# EAGLE design ESP-balanced-mic-line-driver (EAGLE 9.6.2)
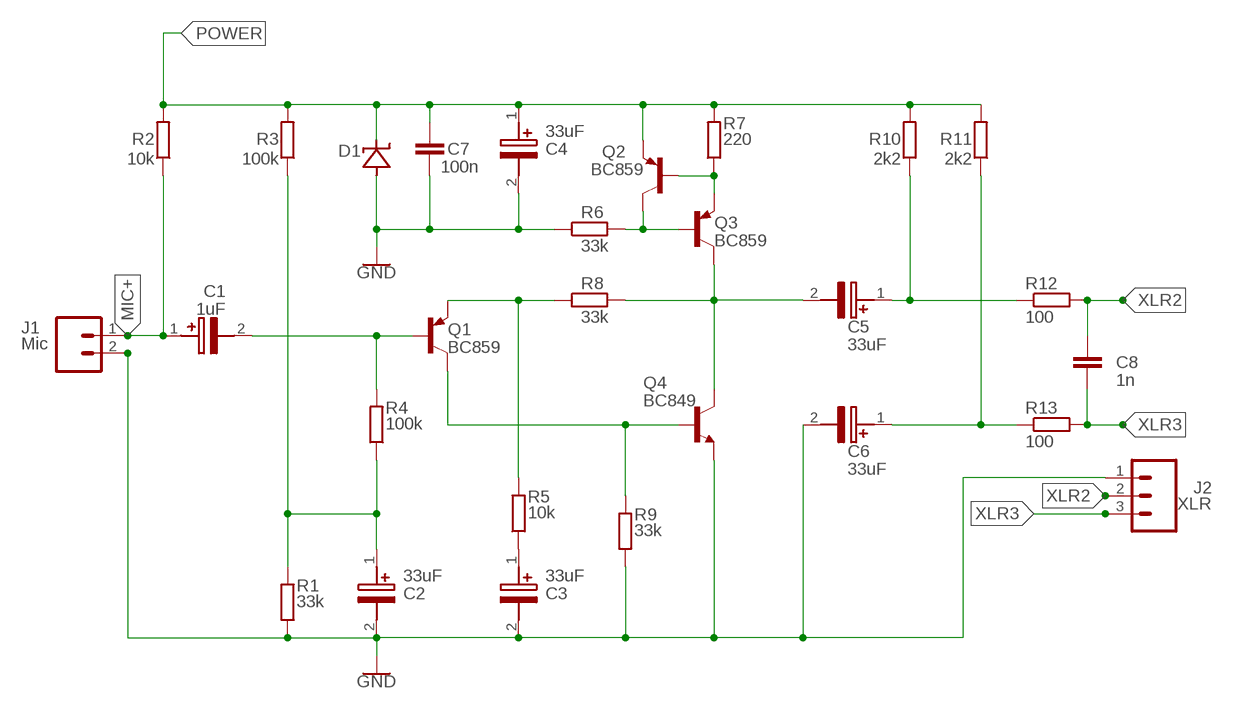
[diagram p0: schematic, sheet 1]

## Parts
C1  1uF  865080442006  [CAPAE530X550N]
C2  33uF  865080442006  [CAPAE530X550N]
C3  33uF  865080442006  [CAPAE530X550N]
C4  33uF  865080442006  [CAPAE530X550N]
C5  33uF  865080442006  [CAPAE530X550N]
C6  33uF  865080442006  [CAPAE530X550N]
C7  100n  C-EUC1210  [C1210]
C8  1n  C-EUC0805  [C0805]
D1  ZENER_D  [SOD123]
J1  Mic  CONN_02  [1X02]
J2  XLR  CONN_03  [1X03]
Q1  BC859  [SOT23-BEC]
Q2  BC859  [SOT23-BEC]
Q3  BC859  [SOT23-BEC]
Q4  BC849  [SOT23-BEC]
R1  33k  R_0603  [R0603]
R2  10k  R_0603  [R0603]
R3  100k  R_0603  [R0603]
R4  100k  R_0603  [R0603]
R5  10k  R_0603  [R0603]
R6  33k  R_0603  [R0603]
R7  220  R_0603  [R0603]
R8  33k  R_0603  [R0603]
R9  33k  R_0603  [R0603]
R10  2k2  R_0603  [R0603]
R11  2k2  R_0603  [R0603]
R12  100  R_0603  [R0603]
R13  100  R_0603  [R0603]

## Nets
GND: C2.2(-) C3.2(-) C4.2(-) C6.2(-) C7.2 D1.A J1.2 J2.1 Q4.E R1.1 R6.1 R9.1
MIC+: C1.1(+) J1.1 R2.1
N$1: C5.2(-) Q3.C Q4.C R8.2
N$2: Q2.C Q3.B R6.2
N$3: C3.1(+) R5.1
N$7: C5.1(+) R10.1 R12.1
N$8: C6.1(+) R11.1 R13.1
N$9: Q2.B Q3.E R7.1
N$13: C2.1(+) R1.2 R3.1 R4.1
N$15: C1.2(-) Q1.B R4.2
N$16: Q1.E R5.2 R8.1
N$17: Q1.C Q4.B R9.2
POWER: C4.1(+) C7.1 D1.C Q2.E R2.2 R3.2 R7.2 R10.2 R11.2
XLR2: C8.1 J2.2 R12.2
XLR3: C8.2 J2.3 R13.2

## Library data of the parts
C1-C6 = SamacSys_Parts:865080442006: Wurth Elektronik 33uF 25 V Aluminium Electrolytic Capacitor, WCAP-ASLI Series 2000h 5 (Dia.) x 5.35mm Source: Datasheet; DESCRIPTION: Wurth Elektronik 33uF 25 V Aluminium Electrolytic Capacitor, WCAP-ASLI Series 2000h 5 (Dia.) x 5.35mm; HEIGHT: 5.5mm; MANUFACTURER_NAME: Wurth Elektronik; MANUFACTURER_PART_NUMBER: 865080442006; MOUSER_PART_NUMBER: 710-865080442006; MOUSER_PRICE-STOCK: https://www.mouser.co.uk/ProductDetail/Wurth-Elektronik/865080442006?qs=0KOYDY2FL28yYWna6YwhXg%3D%3D
C7 C8 = rcl:C-EU: CAPACITOR, European symbol; SPICEPREFIX: C
D1 = MKF:ZENER_D
J1 = MKF:CONN_02: Multi connection point. Often used as Generic Header-pin footprint for 0.1 inch spaced/style header connections On any of the 0.1 inch spaced packages, you can populate with these: Break Away Headers - Straight <https://www.sparkfun.com/products/116> (PRT-00116) Break Away Male Headers - Right Angle <https://www.sparkfun.com/products/553> (PRT-00553) Female Headers <https://www.sparkfun.com/products/115> (PRT-00115) Break Away Headers - Machine Pin <https://www.sparkfun.com/products/117> (PRT-00117) Break Away Female Headers - Swiss Machine Pin <https://www.sparkfun.com/products/743> (PRT-00743) For SCREWTERMINALS and SPRING TERMINALS visit here: Screw Terimnals on SparkFun.com <https://www.sparkfun.com/search/results?term=Screw+Terminals> (5mm/3.5mm/2.54mm spacing) This device is also useful as a general connection point to wire up your design to another part of your project. Our various solder wires solder well into these plated through hole pads. Hook-Up Wire - Assortment (Stranded, 22 AWG) <https://www.sparkfun.com/products/11375> (PRT-11375) Hook-Up Wire - Assortment (Solid Core, 22 AWG) <https://www.sparkfun.com/products/11367> (PRT-11367) View the entire wire category on our website here <https://www.sparkfun.com/categories/141> Special notes: Molex polarized connector foot print use with: PRT-08233 with associated crimp pins and housings. 2.54_SCREWTERM for use with PRT-10571. 3.5mm Screw Terminal footprints for PRT-08084 5mm Screw Terminal footprints for use with PRT-08432
J2 = MKF:CONN_03: Multi connection point. Often used as Generic Header-pin footprint for 0.1 inch spaced/style header connections On any of the 0.1 inch spaced packages, you can populate with these: Break Away Headers - Straight <https://www.sparkfun.com/products/116> (PRT-00116) Break Away Male Headers - Right Angle <https://www.sparkfun.com/products/553> (PRT-00553) Female Headers <https://www.sparkfun.com/products/115> (PRT-00115) Break Away Headers - Machine Pin <https://www.sparkfun.com/products/117> (PRT-00117) Break Away Female Headers - Swiss Machine Pin <https://www.sparkfun.com/products/743> (PRT-00743) Stackable Header - 3 Pin (Female, 0.1") <https://www.sparkfun.com/products/13875> (PRT-13875) For SCREWTERMINALS and SPRING TERMINALS visit here: Screw Terimnals on SparkFun.com <https://www.sparkfun.com/search/results?term=Screw+Terminals> (5mm/3.5mm/2.54mm spacing) This device is also useful as a general connection point to wire up your design to another part of your project. Our various solder wires solder well into these plated through hole pads. Hook-Up Wire - Assortment (Stranded, 22 AWG) <https://www.sparkfun.com/products/11375> (PRT-11375) Hook-Up Wire - Assortment (Solid Core, 22 AWG) <https://www.sparkfun.com/products/11367> (PRT-11367) View the entire wire category on our website here <https://www.sparkfun.com/categories/141> Special notes: Molex polarized connector foot print use with SKU : PRT-08232 with associated crimp pins and housings.
Q1-Q3 = MKF:BC859
Q4 = MKF:BC849
R1-R13 = MKF:R_0603

## Board
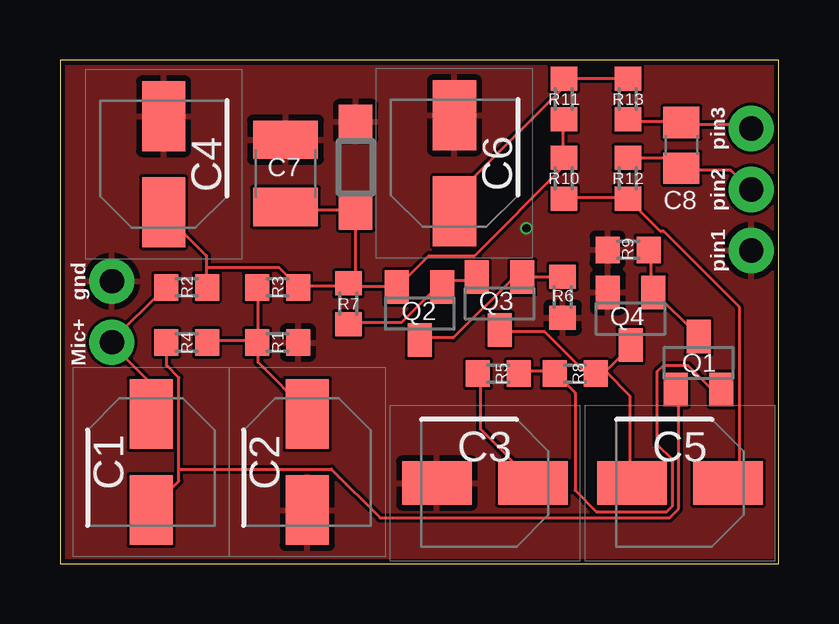
[diagram p1: board, top side]
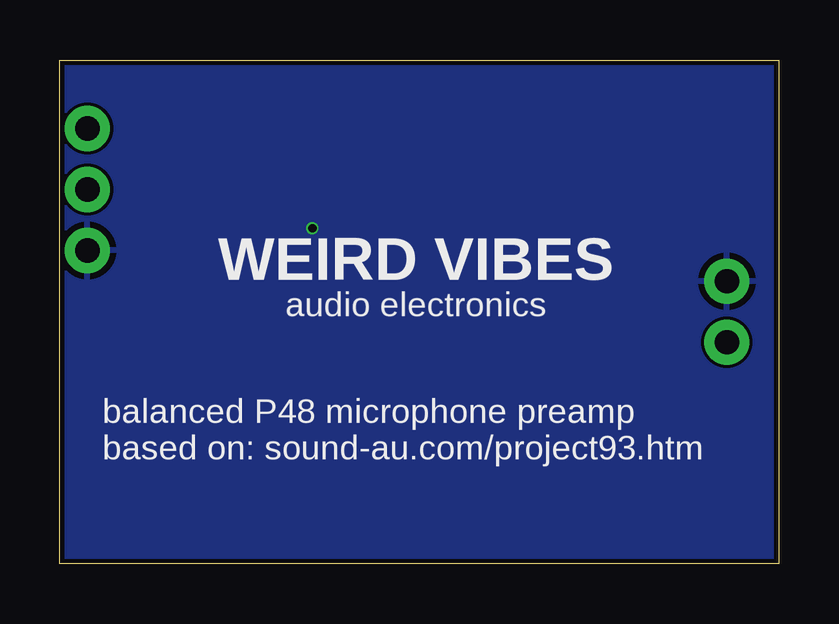
[diagram p2: board, bottom side, seen from below]

Size 29.95 x 20.98 mm. Coordinates in mm from the lower left corner, seen from the top.
Outline: 0,0 29.95,0 29.95,20.98 0,20.98 0,0
Copper layers (1*16): Top 0.035mm / dielectric 1.6mm / Bottom 0.035mm
Design rules "jlcpcb-2layers": minimum track width 5mil, minimum drill 0.3mm, track to track 5mil, track to pad 5mil, pad to pad 5mil, via to via 5mil, smd to smd 5mil, copper to edge 0.2mm, drill to drill 6mil, minimum pad ring 10mil, minimum via ring 3mil, stop-mask expansion 4mil, vias tented up to drill 0mil, thermal gap 10mil

### Footprints (pad centres in the part's own frame; a part is rotated, then mirrored left to right if it is on the bottom)
CAPAE530X550N = smd 2.9 x 1.8: 1 -2,0; 2 2,0
C1210 = smd 1.6 x 2.7: 1 -1.4,0; 2 1.4,0
C0805 = smd 1.3 x 1.5: 1 -0.95,0; 2 0.95,0
SOD123 = smd 1.4 x 1.4: A 1.9,0; C -1.9,0
1X02 = drill 1.016 pad 1.88: 1 0,0; 2 2.54,0
1X03 = drill 1.016 pad 1.88: 1 0,0; 2 2.54,0; 3 5.08,0
SOT23-BEC = smd 1 x 1.4: B -0.95,-1.1; C 0,1.1; E 0.95,-1.1
R0603 = smd 1 x 1.1: 1 -0.85,0; 2 0.85,0

### Placement (x,y rotation side)
C1  3.8,4.23 270 top
C2  10.3,4.23 270 top
C3  17.7,3.35 180 top
C4  4.32,16.64 90 top
C5  25.83,3.35 180 top
C6  16.43,16.68 90 top
C7  9.4,16.26 90 top
C8  25.9,17.42 90 top
D1  12.32,16.51 90 top
J1  2.16,9.22 90 top
J2  28.8,13.04 90 top
Q1  26.61,8.36 0 top
Q2  14.99,10.41 180 top
Q3  18.31,10.83 180 top
Q4  23.77,10.2 180 top
R1  9.07,9.21 180 top
R2  5.28,11.51 0 top
R3  9.07,11.51 0 top
R4  5.28,9.21 180 top
R5  18.26,7.91 0 top
R6  20.94,11.1 90 top
R7  12.01,10.82 90 top
R8  21.46,7.91 0 top
R9  23.67,13.07 0 top
R10  20.99,16.05 90 top
R11  20.99,19.35 270 top
R12  23.66,16.05 90 top
R13  23.66,19.35 270 top

### Tracks (layer width: path | path; a pad name or v marks a point on that pad's centre or on a via)
GND  (via drill 0.35)
  other vias: 19.43,13.97
  pour Top: -1.14,22.61 30.61,22.61 30.61,-0.51 -1.14,-0.51
  pour Bottom: -1.14,23.11 30.61,23.11 30.61,-1.02 -1.14,-1.02
MIC+
  Top 0.127: R2.1 4.32,11.43 2.16,9.27 J1.1 2.16,9.14 3.68,7.62 3.68,6.35 C1.1
N$1
  Top 0.127: 22.73,8 22.35,8 R8.2 | 22.73,8 23.75,9.02 Q4.C | Q3.C 18.41,9.65 20.19,9.65 21.84,8 22.22,8 R8.2 | 22.73,8 23.75,6.98 23.75,3.43 C5.2 | 22.73,8 R8.2
N$2
  Top 0.127: R6.2 20.83,11.94 19.3,11.94 Q3.B 19.18,11.81 18.8,11.81 16.38,9.4 14.99,9.4 Q2.C
N$3
  Top 0.127: R5.1 17.53,7.87 17.53,5.59 19.68,3.43 C3.1
N$7
  Top 0.127: R10.1 21.08,15.24 23.62,15.24 R12.1 23.75,15.11 25.02,13.84 25.15,13.84 28.32,10.67 28.32,3.81 27.94,3.43 C5.1
N$8
  Top 0.127: R13.1 23.62,20.19 21.08,20.19 R11.1 20.95,20.19 20.95,19.81 16.51,15.37 16.51,14.73 C6.1
N$9
  Top 0.127: R7.1 12.07,10.03 14.22,10.03 15.62,11.43 15.88,11.43 Q2.B 16,11.56 16.26,11.81 17.27,11.81 Q3.E
N$13
  Top 0.127: R4.1 6.22,9.27 8.13,9.27 R1.2 | R3.1 8.26,11.43 8.26,9.27 R1.2 | R1.2 8.26,9.14 8.26,8.38 10.29,6.35 C2.1
N$15
  Top 0.127: 4.95,3.94 4.95,3.43 3.81,2.29 C1.2 | 4.95,3.94 4.95,7.75 4.44,8.25 4.44,9.14 R4.2 | 4.95,3.94 11.3,3.94 13.34,1.91 25.4,1.91 25.78,2.29 25.78,7.24 Q1.B
N$16
  Top 0.127: R5.2 19.18,8 20.57,8 R8.1 20.7,7.87 21.46,7.11 21.46,3.05 22.35,2.16 25.27,2.16 25.53,2.41 25.53,4.32 24.89,4.95 24.89,8 25.15,8.25 26.16,8.25 27.05,7.37 27.43,7.37 Q1.E
N$17
  Top 0.127: R9.2 24.64,12.95 24.64,11.3 Q4.B 24.77,11.3 26.54,9.53 Q1.C
POWER
  Top 0.127: 6.1,12.32 6.1,12.83 4.32,14.61 C4.1 | 6.1,12.32 6.1,11.56 R2.2 | C7.1 9.4,14.73 12.32,14.73 D1.C 12.32,11.56 | R11.2 20.95,18.42 20.95,17.02 R10.2 20.95,16.89 20.95,16.51 17.27,12.83 15.37,12.83 14.1,11.56 Q2.E 13.97,11.56 12.32,11.56 | 12.07,11.56 11.94,11.56 | 11.94,11.56 10.03,11.56 R3.2 9.91,11.56 9.14,12.32 6.1,12.32 | 11.94,11.56 R7.2 | 12.07,11.56 12.19,11.56 | 12.19,11.56 12.32,11.56 | 12.07,11.56 R7.2 | 12.19,11.56 R7.2
XLR2
  Top 0.127: R12.2 23.75,16.89 25.4,16.89 25.78,16.51 C8.1 25.91,16.38 27.94,16.38 28.7,15.62 J2.2
XLR3
  Top 0.127: R13.2 23.75,18.42 25.78,18.42 C8.2 25.91,18.29 28.57,18.29 28.7,18.16 J2.3

### Text on the board
bPlace: WEIRD VIBES | audio electronics | balanced P48 microphone preamp / based on: sound-au.com/project93.htm